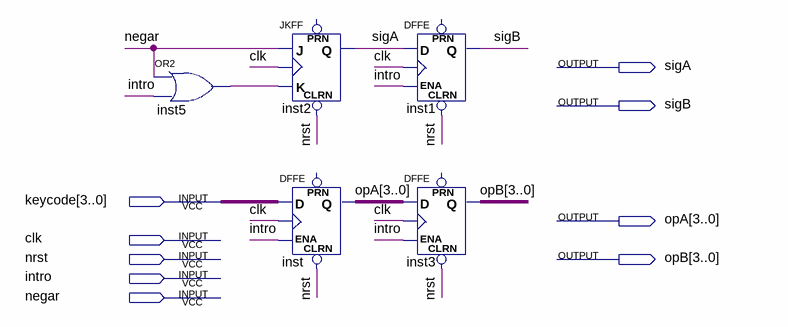
[diagram p0: schematic sheet]
// Quartus schematic regs.bdf as structural Verilog: 5 symbols, 9 pins
module regs (
  input  [3:0] keycode,
  input  clk,
  input  nrst,
  input  intro,
  input  negar,
  output sigA,
  output sigB,
  output [3:0] opA,
  output [3:0] opB
);

  wire inst5_out;

  or inst5 (inst5_out, negar, intro);
  JKFF inst2 (.CLRN(nrst), .K(inst5_out), .J(negar), .CLK(clk), .Q(sigA));  // open: PRN
  DFFE inst[3:0] (.CLRN(nrst), .D(keycode), .CLK(clk), .ENA(intro), .Q(opA));  // open: PRN
  DFFE inst1 (.CLRN(nrst), .D(sigA), .CLK(clk), .ENA(intro), .Q(sigB));  // open: PRN
  DFFE inst3[3:0] (.CLRN(nrst), .D(opA), .CLK(clk), .ENA(intro), .Q(opB));  // open: PRN
endmodule
